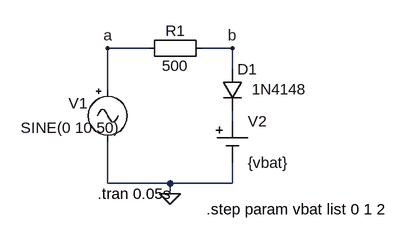
[diagram p0: schematic limiter_diod_positive_bat.asc]
limiter_diod_positive_bat.asc, the LTspice schematic file:
Version 4
SHEET 1 880 680
WIRE 16 208 -48 208
WIRE 144 208 96 208
WIRE 144 240 144 208
WIRE -48 272 -48 208
WIRE 144 320 144 304
WIRE -48 416 -48 352
WIRE 48 416 -48 416
WIRE 144 416 144 384
WIRE 144 416 48 416
WIRE 48 432 48 416
FLAG -48 208 a
FLAG 144 208 b
FLAG 48 432 0
SYMBOL diode 128 240 R0
WINDOW 3 46 31 Left 2
SYMATTR InstName D1
SYMATTR Value 1N4148
SYMBOL Misc\\signal -48 256 R0
WINDOW 123 0 0 Left 2
WINDOW 39 0 0 Left 2
WINDOW 3 -134 74 Left 2
WINDOW 0 -60 37 Left 2
SYMATTR Value SINE(0 10 50)
SYMATTR InstName V1
SYMBOL Misc\\EuropeanResistor 112 192 R90
WINDOW 0 5 56 VBottom 2
WINDOW 3 27 56 VTop 2
SYMATTR InstName R1
SYMATTR Value 500
SYMBOL Misc\\cell 144 320 R0
WINDOW 123 0 0 Left 0
WINDOW 39 0 0 Left 0
SYMATTR InstName V2
SYMATTR Value {vbat}
TEXT -64 432 Left 2 !.tran 0.05s
TEXT 104 456 Left 2 !.step param vbat list 0 1 2

The netlist it stands for:
* limiter_diod_positive_bat.asc
D1 b N001 1N4148
V1 a 0 SINE(0 10 50)
R1 b a 500
V2 N001 0 {vbat}
.model D D
.lib standard.dio
.tran 0.05s
.step param vbat list 0 1 2
.backanno
.end